# EAGLE design brake_controller (EAGLE 5.06)
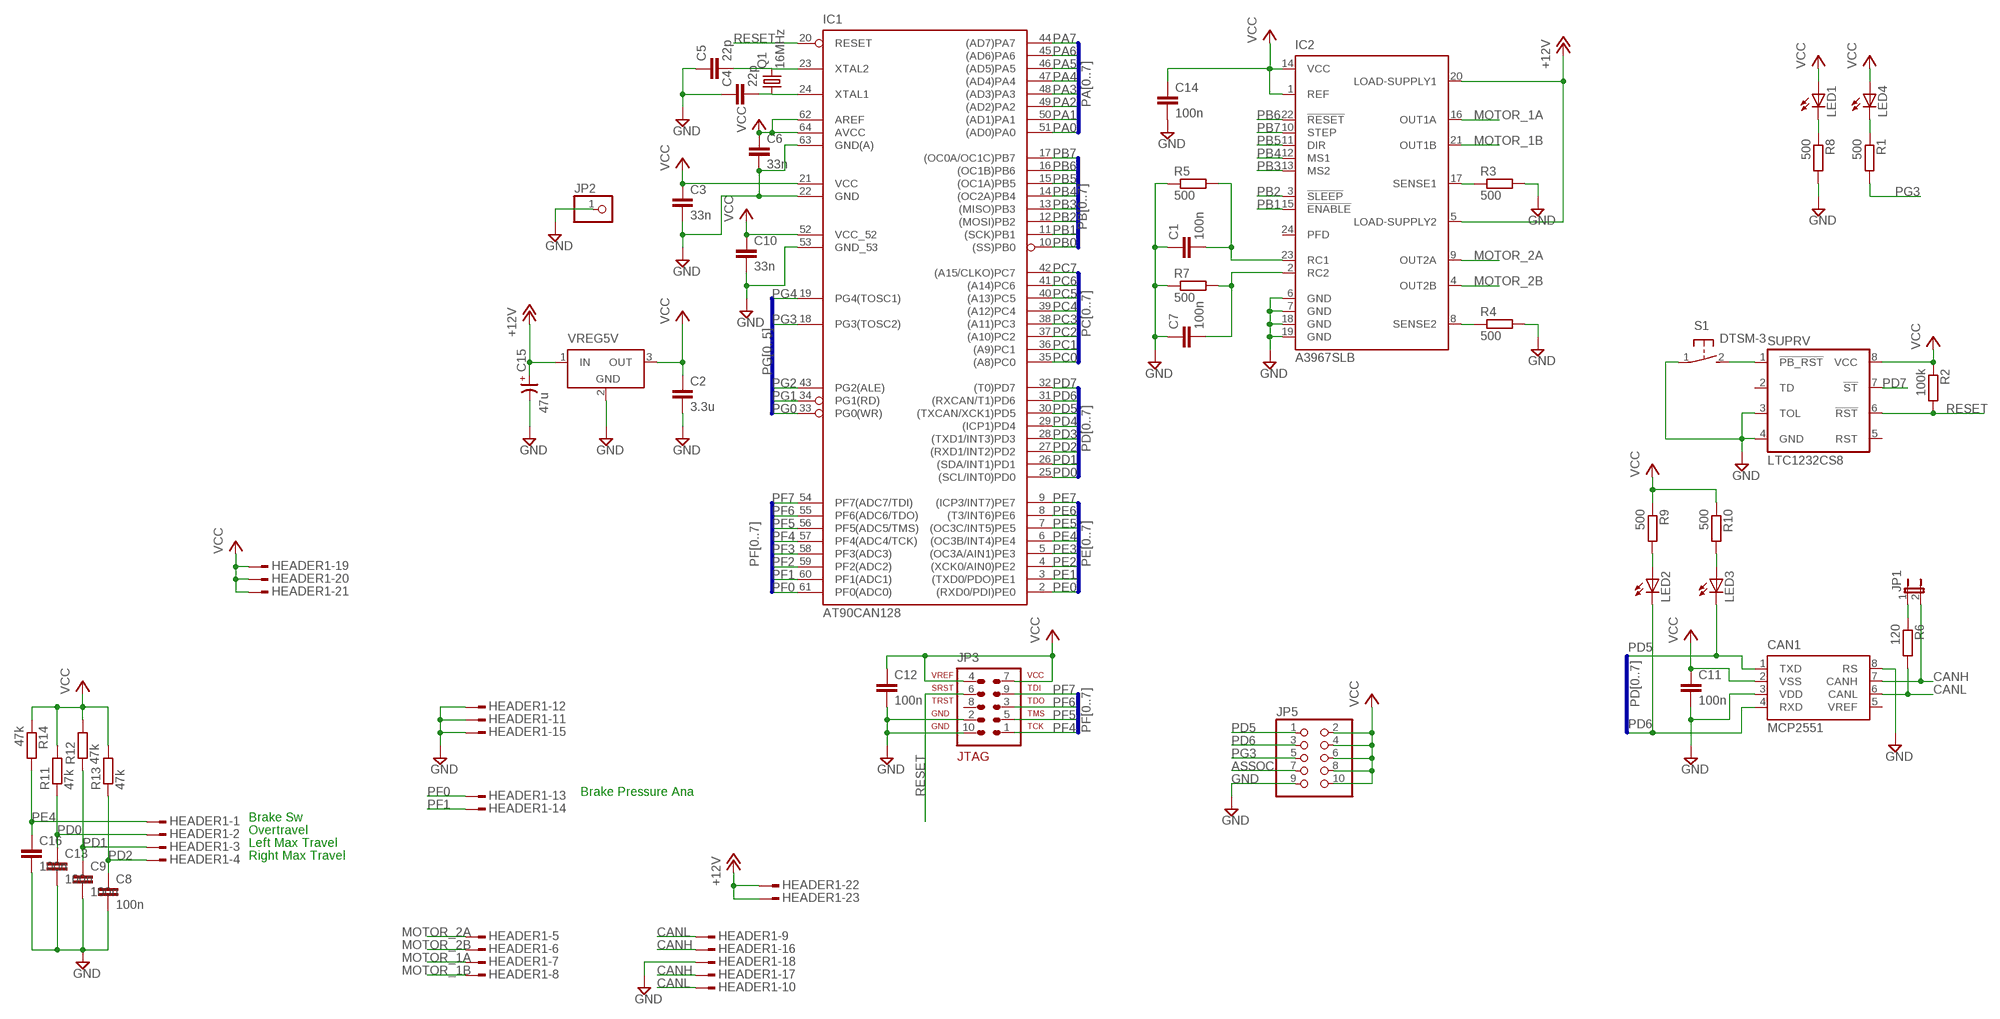
[diagram p0: schematic, sheet 1]

## Parts
C1  100n  C-EUC1206  [C1206]
C2  3.3u  C-EUC1206  [C1206]
C3  33n  C-EUC1206  [C1206]
C4  22p  C-EUC1206  [C1206]
C5  22p  C-EUC1206  [C1206]
C6  33n  C-EUC1206  [C1206]
C7  100n  C-EUC1206  [C1206]
C8  100n  C-EUC1206  [C1206]
C9  100n  C-EUC1206  [C1206]
C10  33n  C-EUC1206  [C1206]
C11  100n  C-EUC1206  [C1206]
C12  100n  C-EUC1206  [C1206]
C13  100n  C-EUC1206  [C1206]
C14  100n  C-EUC1206  [C1206]
C15  47u  CP-SV-E/F  [SV-E/F]
C16  100n  C-EUC1206  [C1206]
CAN1  MCP2551  [SOIC8]
HEADER1  AMPSEAL23-HEADER  [AMPSEAL23-HEADER]
IC1  AT90CAN128  [TQFP64]
IC2  A3967SLB  [SO24W]
JP1  JP1E  [JP1]
JP2  PINHD-1X1  [1X01]
JP3  AVR-JTAG-10  [AVR-JTAG-10]
JP5  PINHD-2X5  [2X05]
LED1  LEDCHIPLED_1206  [CHIPLED_1206]
LED2  LEDCHIPLED_1206  [CHIPLED_1206]
LED3  LEDCHIPLED_1206  [CHIPLED_1206]
LED4  LEDCHIPLED_1206  [CHIPLED_1206]
Q1  16MHz  CRYSTALHC49UP  [HC49UP]
R1  500  R-EU_R1206  [R1206]
R2  100k  R-EU_R1206  [R1206]
R3  500  R-EU_R1206  [R1206]
R4  500  R-EU_R1206  [R1206]
R5  500  R-EU_R1206  [R1206]
R6  120  R-EU_R1206  [R1206]
R7  500  R-EU_R1206  [R1206]
R8  500  R-EU_R1206  [R1206]
R9  500  R-EU_R1206  [R1206]
R10  500  R-EU_R1206  [R1206]
R11  47k  R-EU_R1206  [R1206]
R12  47k  R-EU_R1206  [R1206]
R13  47k  R-EU_R1206  [R1206]
R14  47k  R-EU_R1206  [R1206]
S1  DTSM-3  [DTSM-3]
SUPRV  LTC1232CS8  [SOIC8]
VREG5V  LT1129CST5  [SOT223]

## Nets
+12V: C15.+ HEADER1.22 HEADER1.23 IC2.5(LOAD-SUPPLY2) IC2.20(LOAD-SUPPLY1) VREG5V.1(IN)
ASSOC: JP5.7
CANH: CAN1.7(CANH) HEADER1.16 HEADER1.17 JP1.2
CANL: CAN1.6(CANL) HEADER1.9 HEADER1.10 R6.2
GND: C1.1 C2.2 C3.2 C4.1 C5.1 C6.2 C7.1 C8.2 C9.2 C10.2 C11.2 C12.2 C13.2 C14.2 C15.- C16.2 CAN1.3(VDD) CAN1.8(RS) HEADER1.11 HEADER1.12 HEADER1.15 HEADER1.18 IC1.22(GND) IC1.53(GND_53) IC1.63(GND(A)) IC2.6(GND) IC2.7(GND) IC2.18(GND) IC2.19(GND) JP2.1 JP3.2 JP3.10 JP5.9 R3.2 R4.2 R5.1 R7.1 R8.2 S1.1 SUPRV.3(TOL) SUPRV.4(GND) VREG5V.2(GND)
MOTOR_1A: HEADER1.7 IC2.16(OUT1A)
MOTOR_1B: HEADER1.8 IC2.21(OUT1B)
MOTOR_2A: HEADER1.5 IC2.9(OUT2A)
MOTOR_2B: HEADER1.6 IC2.4(OUT2B)
N$1: LED4.C R1.1
N$2: IC2.17(SENSE1) R3.1
N$3: IC2.8(SENSE2) R4.1
N$4: C5.2 IC1.23(XTAL2) Q1.2
N$5: C4.2 IC1.24(XTAL1) Q1.1
N$9: C1.2 IC2.23(RC1) R5.2
N$10: C7.2 IC2.2(RC2) R7.2
N$18: S1.2 SUPRV.1(!PB_RST)
N$19: JP1.1 R6.1
N$20: LED1.C R8.1
N$21: LED2.A R9.2
N$23: LED3.A R10.2
PA0: IC1.51((AD0)PA0)
PA1: IC1.50((AD1)PA1)
PA2: IC1.49((AD2)PA2)
PA3: IC1.48((AD3)PA3)
PA4: IC1.47((AD4)PA4)
PA5: IC1.46((AD5)PA5)
PA6: IC1.45((AD6)PA6)
PA7: IC1.44((AD7)PA7)
PB0: IC1.10((SS)PB0)
PB1: IC1.11((SCK)PB1) IC2.15(!ENABLE)
PB2: IC1.12((MOSI)PB2) IC2.3(!SLEEP)
PB3: IC1.13((MISO)PB3) IC2.13(MS2)
PB4: IC1.14((OC2A)PB4) IC2.12(MS1)
PB5: IC1.15((OC1A)PB5) IC2.11(DIR)
PB6: IC1.16((OC1B)PB6) IC2.22(!RESET)
PB7: IC1.17((OC0A/OC1C)PB7) IC2.10(STEP)
PC0: IC1.35((A8)PC0)
PC1: IC1.36((A9)PC1)
PC2: IC1.37((A10)PC2)
PC3: IC1.38((A11)PC3)
PC4: IC1.39((A12)PC4)
PC5: IC1.40((A13)PC5)
PC6: IC1.41((A14)PC6)
PC7: IC1.42((A15/CLKO)PC7)
PD0: C13.1 HEADER1.2 IC1.25((SCL/INT0)PD0) R11.1
PD1: C9.1 HEADER1.3 IC1.26((SDA/INT1)PD1) R12.1
PD2: C8.1 HEADER1.4 IC1.27((RXD1/INT2)PD2) R13.1
PD3: IC1.28((TXD1/INT3)PD3)
PD4: IC1.29((ICP1)PD4)
PD5: CAN1.1(TXD) IC1.30((TXCAN/XCK1)PD5) JP5.1 LED3.C
PD6: CAN1.4(RXD) IC1.31((RXCAN/T1)PD6) JP5.3 LED2.C
PD7: IC1.32((T0)PD7) SUPRV.7(!ST)
PE0: IC1.2((RXD0/PDI)PE0)
PE1: IC1.3((TXD0/PDO)PE1)
PE2: IC1.4((XCK0/AIN0)PE2)
PE3: IC1.5((OC3A/AIN1)PE3)
PE4: C16.1 HEADER1.1 IC1.6((OC3B/INT4)PE4) R14.2
PE5: IC1.7((OC3C/INT5)PE5)
PE6: IC1.8((T3/INT6)PE6)
PE7: IC1.9((ICP3/INT7)PE7)
PF0: HEADER1.13 IC1.61(PF0(ADC0))
PF1: HEADER1.14 IC1.60(PF1(ADC1))
PF2: IC1.59(PF2(ADC2))
PF3: IC1.58(PF3(ADC3))
PF4: IC1.57(PF4(ADC4/TCK)) JP3.1
PF5: IC1.56(PF5(ADC5/TMS)) JP3.5
PF6: IC1.55(PF6(ADC6/TDO)) JP3.3
PF7: IC1.54(PF7(ADC7/TDI)) JP3.9
PG0: IC1.33(PG0(WR))
PG1: IC1.34(PG1(RD))
PG2: IC1.43(PG2(ALE))
PG3: IC1.18(PG3(TOSC2)) JP5.5 R1.2
PG4: IC1.19(PG4(TOSC1))
RESET: IC1.20(RESET) JP3.6 R2.2 SUPRV.6(!RST)
VCC: C2.1 C3.1 C6.1 C10.1 C11.1 C12.1 C14.1 CAN1.2(VSS) HEADER1.19 HEADER1.20 HEADER1.21 IC1.21(VCC) IC1.52(VCC_52) IC1.62(AREF) IC1.64(AVCC) IC2.1(REF) IC2.14(VCC) JP3.4 JP3.7 JP5.2 JP5.4 JP5.6 JP5.8 JP5.10 LED1.A LED4.A R2.1 R9.1 R10.1 R11.2 R12.2 R13.2 R14.1 SUPRV.8(VCC) VREG5V.3(OUT)
Unconnected: IC2.24(PFD) JP3.8 SUPRV.2(TD) SUPRV.5(RST)

## Buses
PD[0..7]
PF[0..7]
PE[0..7]
PB[0..7]
PA[0..7]
PC[0..7]
PG[0..5]

## Notes on the sheet
- Brake Pressure Ana
- Brake Sw
- Overtravel
- Left Max Travel
- Right Max Travel

## Power pins joined to a net without a drawn wire
GND: VREG5V.4(GND)
VREF: CAN1.5(VREF)

## Library data of the parts
C1-C14 C16 = resistor:C-EU: CAPACITOR, European symbol
C15 = cap-master:CP-: POLARIZED CAP
CAN1 = MCP2551:MCP2551
HEADER1 = ampseal:AMPSEAL23-HEADER: HEADER ASSEMBLY, 23 POSITION, SNAP-IN, AMPSEAL
IC1 = at90can128:AT90CAN128
IC2 = allegro:A3967SLB: MICROSTEPPING DRIVER WITH TRANSLATOR Source: 3967.pdf
JP1 = jumper:JP1E: JUMPER
JP2 = pinhead:PINHD-1X1: PIN HEADER
JP3 = atmel:AVR-JTAG-10: AVR JTAG Debug/Programming Header
JP5 = pinhead:PINHD-2X5: PIN HEADER
LED1-LED4 = led:LED: LED OSRAM: - CHIPLED LG R971, LG N971, LY N971, LG Q971, LY Q971, LO R971, LY R971 LH N974, LH R974 LS Q976, LO Q976, LY Q976 LO Q996 - Hyper CHIPLED LW Q18S LB Q993, LB Q99A, LB R99A - SideLED LS A670, LO A670, LY A670, LG A670, LP A670 LB A673, LV A673, LT A673, LW A673 LH A674 LY A675 LS A676, LA A676, LO A676, LY A676, LW A676 LS A679, LY A679, LG A679 - Hyper Micro SIDELED® LS Y876, LA Y876, LO Y876, LY Y876 LT Y87S - SmartLED LW L88C, LW L88S LB L89C, LB L89S, LG L890 LS L89K, LO L89K, LY L89K LS L896, LA L896, LO L896, LY L896 - TOPLED LS T670, LO T670, LY T670, LG T670, LP T670 LSG T670, LSP T670, LSY T670, LOP T670, LYG T670 LG T671, LOG T671, LSG T671 LB T673, LV T673, LT T673, LW T673 LH T674 LS T676, LA T676, LO T676, LY T676, LB T676, LH T676, LSB T676, LW T676 LB T67C, LV T67C, LT T67C, LS T67K, LO T67K, LY T67K, LW E67C LS E67B, LA E67B, LO E67B, LY E67B, LB E67C, LV E67C, LT E67C LW T67C LS T679, LY T679, LG T679 LS T770, LO T770, LY T770, LG T770, LP T770 LB T773, LV T773, LT T773, LW T773 LH T774 LS E675, LA E675, LY E675, LS T675 LS T776, LA T776, LO T776, LY T776, LB T776 LHGB T686 LT T68C, LB T68C - Hyper Mini TOPLED® LB M676 - Mini TOPLED Santana® LG M470 LS M47K, LO M47K, LY M47K Source: http://www.osram.convergy.de LUXEON: - LUMILED® LXK2-PW12-R00, LXK2-PW12-S00, LXK2-PW14-U00, LXK2-PW14-V00 LXK2-PM12-R00, LXK2-PM12-S00, LXK2-PM14-U00 LXK2-PE12-Q00, LXK2-PE12-R00, LXK2-PE12-S00, LXK2-PE14-T00, LXK2-PE14-U00 LXK2-PB12-K00, LXK2-PB12-L00, LXK2-PB12-M00, LXK2-PB14-N00, LXK2-PB14-P00, LXK2-PB14-Q00 LXK2-PR12-L00, LXK2-PR12-M00, LXK2-PR14-Q00, LXK2-PR14-R00 LXK2-PD12-Q00, LXK2-PD12-R00, LXK2-PD12-S00 LXK2-PH12-R00, LXK2-PH12-S00 LXK2-PL12-P00, LXK2-PL12-Q00, LXK2-PL12-R00 Source: www.luxeon.com KINGBRIGHT: KA-3528ASYC Source: www.kingbright.com
Q1 = crystal:CRYSTAL: CRYSTAL
R1-R14 = resistor:R-EU_: RESISTOR, European symbol
S1 = switch-tact:DTSM-3
SUPRV = linear:LTC1232: Microprocessor Supervisory Circuit
VREG5V = linear-technology:LT1129CST5: VOLTAGE REGULATOR with shutdown

## Board
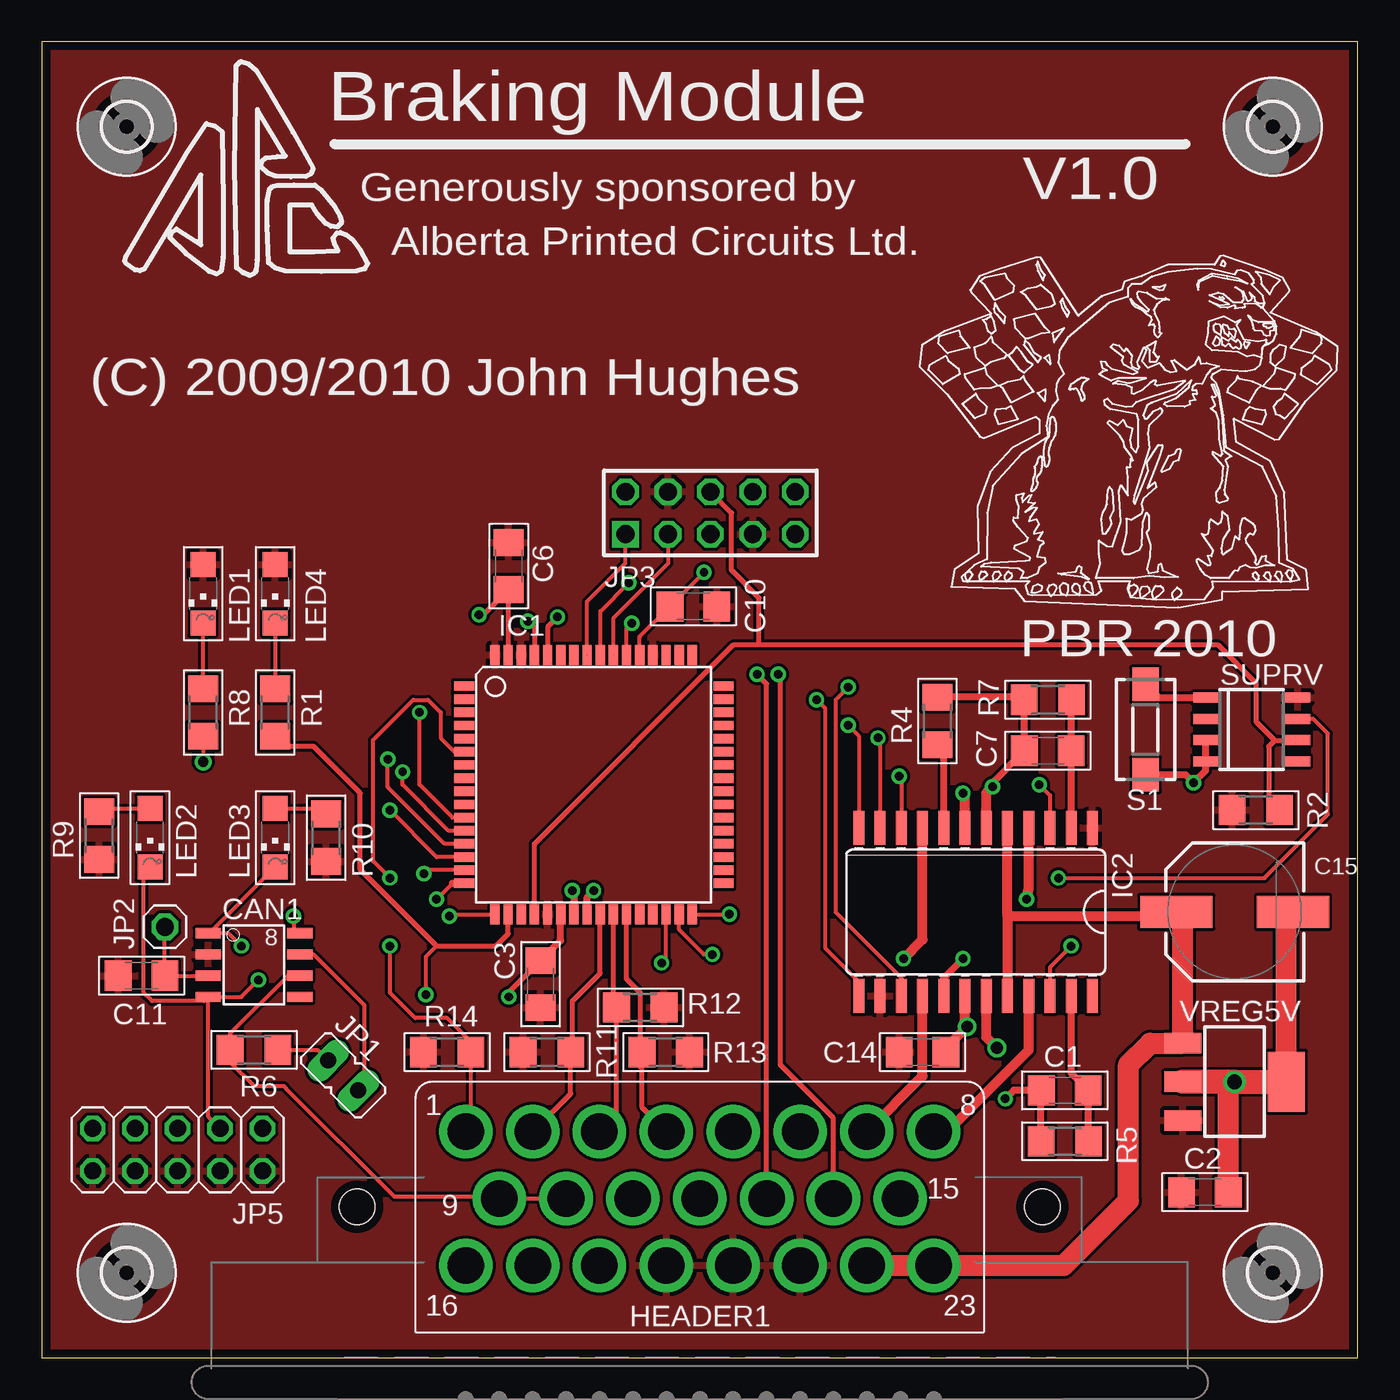
[diagram p1: board, top side]
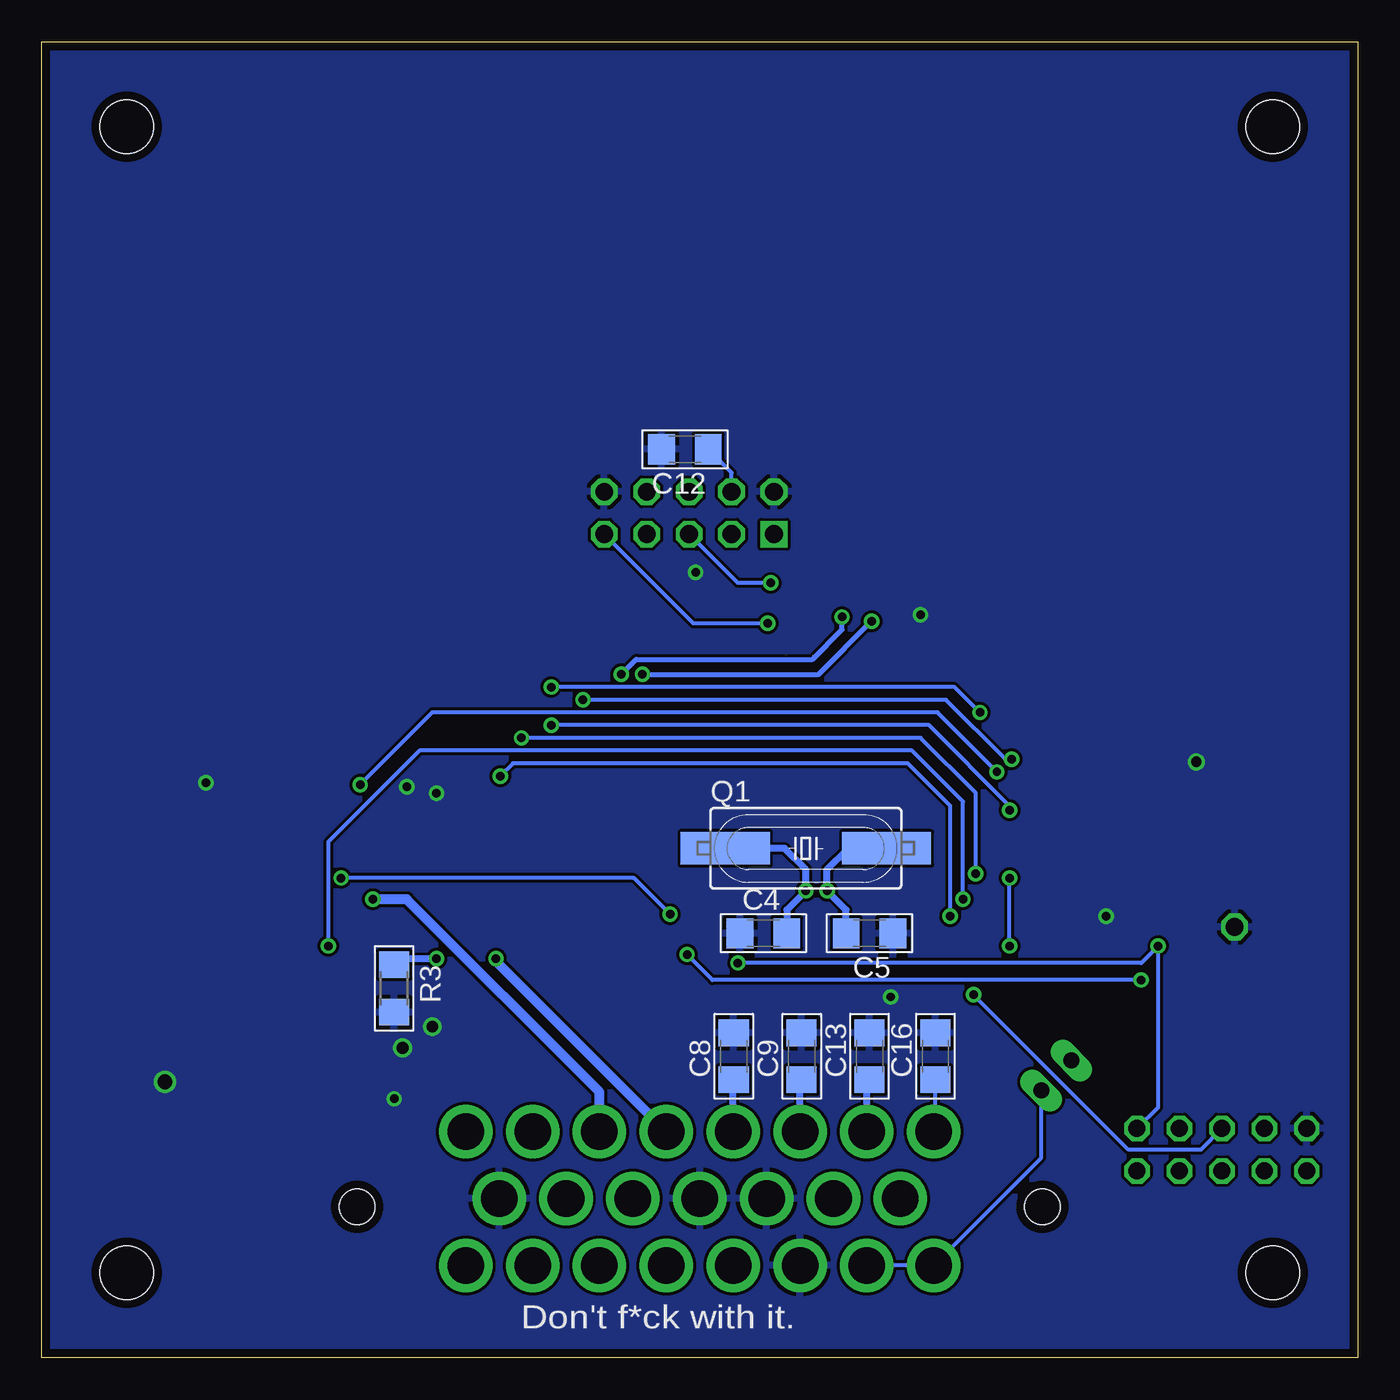
[diagram p2: board, bottom side, seen from below]

Size 78.74 x 78.74 mm. Coordinates in mm from the lower left corner, seen from the top.
Outline: 0,0 78.74,0 78.74,78.74 0,78.74 0,0
Copper layers (1*16): Top 0.035mm / dielectric 1.5mm / Bottom 0.035mm
Design rules "APCircuits": minimum track width 7mil, minimum drill 16mil, track to track 7mil, track to pad 7mil, pad to pad 7mil, via to via 7mil, smd to smd 7mil, copper to edge 20mil, drill to drill 7mil, minimum pad ring 10mil, minimum via ring 8mil, stop-mask expansion 4mil, vias tented up to drill 0mil, thermal gap 10mil

### Footprints (pad centres in the part's own frame; a part is rotated, then mirrored left to right if it is on the bottom)
C1206 = smd 1.6 x 1.8: 1 -1.4,0; 2 1.4,0
SV-E/F = smd 4.318 x 1.93: + -3.493,0; - 3.493,0
SOIC8 = smd 0.61 x 1.524: 1 -2.54,-2.743; 2 -1.27,-2.743; 3 0,-2.743; 4 1.27,-2.743; 5 1.27,2.743; 6 0,2.743; 7 -1.27,2.743; 8 -2.54,2.743
AMPSEAL23-HEADER = drill 2.184 round: 1 -14,4; 2 -10,4; 3 -6,4; 4 -2,4; 5 2,4; 6 6,4; 7 10,4; 8 14,4; 9 -12,0; 10 -8,0; 11 -4,0; 12 0,0; 13 4,0; 14 8,0; 15 12,0; 16 -14,-4; 17 -10,-4; 18 -6,-4; 19 -2,-4; 20 2,-4; 21 6,-4; 22 10,-4; 23 14,-4 | hole 2.108: -20.5,-0.5; 20.5,-0.5
TQFP64 = smd 1.194 x 0.559: 1 -7.76,5.905; 2 -7.76,5.118; 3 -7.76,4.331; 4 -7.76,3.543; 5 -7.76,2.756; 6 -7.76,1.968; 7 -7.76,1.181; 8 -7.76,0.394; 9 -7.76,-0.394; 10 -7.76,-1.181; 11 -7.76,-1.968; 12 -7.76,-2.756; 13 -7.76,-3.543; 14 -7.76,-4.331; 15 -7.76,-5.118; 16 -7.76,-5.905; 33 7.76,-5.905; 34 7.76,-5.118; 35 7.76,-4.331; 36 7.76,-3.543; 37 7.76,-2.756; 38 7.76,-1.968; 39 7.76,-1.181; 40 7.76,-0.394; 41 7.76,0.394; 42 7.76,1.181; 43 7.76,1.968; 44 7.76,2.756; 45 7.76,3.543; 46 7.76,4.331; 47 7.76,5.118; 48 7.76,5.905 | smd 0.559 x 1.194: 17 -5.905,-7.76; 18 -5.118,-7.76; 19 -4.331,-7.76; 20 -3.543,-7.76; 21 -2.756,-7.76; 22 -1.968,-7.76; 23 -1.181,-7.76; 24 -0.394,-7.76; 25 0.394,-7.76; 26 1.181,-7.76; 27 1.968,-7.76; 28 2.756,-7.76; 29 3.543,-7.76; 30 4.331,-7.76; 31 5.118,-7.76; 32 5.905,-7.76; 49 5.905,7.76; 50 5.118,7.76; 51 4.331,7.76; 52 3.543,7.76; 53 2.756,7.76; 54 1.968,7.76; 55 1.181,7.76; 56 0.394,7.76; 57 -0.394,7.76; 58 -1.181,7.76; 59 -1.968,7.76; 60 -2.756,7.76; 61 -3.543,7.76; 62 -4.331,7.76; 63 -5.118,7.76; 64 -5.905,7.76
SO24W = smd 0.66 x 2.032: 1 -6.985,-5.029; 2 -5.715,-5.029; 3 -4.445,-5.029; 4 -3.175,-5.029; 5 -1.905,-5.029; 6 -0.635,-5.029; 7 0.635,-5.029; 8 1.905,-5.029; 9 3.175,-5.029; 10 4.445,-5.029; 11 5.715,-5.029; 12 6.985,-5.029; 13 6.985,5.029; 14 5.715,5.029; 15 4.445,5.029; 16 3.175,5.029; 17 1.905,5.029; 18 0.635,5.029; 19 -0.635,5.029; 20 -1.905,5.029; 21 -3.175,5.029; 22 -4.445,5.029; 23 -5.715,5.029; 24 -6.985,5.029
JP1 = drill 0.965 long: 1 0,-1.27; 2 0,1.27
1X01 = drill 1.067 octagon: 1 0,0
AVR-JTAG-10 = drill 1.067 square: 1 -5.08,-1.27 | drill 1.067 octagon: 2 -5.08,1.27; 3 -2.54,-1.27; 4 -2.54,1.27; 5 0,-1.27; 6 0,1.27; 7 2.54,-1.27; 8 2.54,1.27; 9 5.08,-1.27; 10 5.08,1.27
2X05 = drill 1.016 octagon: 1 -5.08,-1.27; 2 -5.08,1.27; 3 -2.54,-1.27; 4 -2.54,1.27; 5 0,-1.27; 6 0,1.27; 7 2.54,-1.27; 8 2.54,1.27; 9 5.08,-1.27; 10 5.08,1.27
CHIPLED_1206 = smd 1.5 x 1.5: A 0,-1.75; C 0,1.75
HC49UP = smd 5.334 x 1.93: 1 -4.826,0; 2 4.826,0
R1206 = smd 1.6 x 1.803: 1 -1.422,0; 2 1.422,0
DTSM-3 = smd 2 x 1.6: 1 -2.7,0; 2 2.7,0
SOIC8' = smd 0.6 x 1.5: 1 -1.905,-2.75; 2 -0.635,-2.75; 3 0.635,-2.75; 4 1.905,-2.75; 5 1.905,2.75; 6 0.635,2.75; 7 -0.635,2.75; 8 -1.905,2.75
1/8" = hole 3.175: 0,0
SOT223 = smd 1.219 x 2.235: 1 -2.311,-3.099; 2 0,-3.099; 3 2.311,-3.099 | smd 3.6 x 2.2: 4 0,3.099

### Placement (x,y rotation side)
C1  61.21,16 0 top
C2  69.6,9.91 0 top
C3  29.84,22.35 90 top
C4  35.56,25.4 0 bottom
C5  29.21,25.4 180 bottom
C6  27.94,47.37 270 top
C7  60.2,36.32 0 top
C8  37.34,18.03 90 bottom
C9  33.27,18.03 90 bottom
C10  38.99,44.96 180 top
C11  5.97,22.86 0 top
C12  40.26,54.36 180 bottom
C13  29.21,18.03 90 bottom
C14  52.7,18.29 0 top
C15  71.37,26.67 0 top
C16  25.27,18.03 90 bottom
CAN1  12.7,22.86 270 top
HEADER1  39.37,9.53 0 top
IC1  33.02,34.29 0 top
IC2  55.88,26.67 180 top
JP1  18.03,16.89 225 top
JP2  7.37,25.78 90 top
JP3  40.01,50.55 0 top
JP5  8.13,12.45 180 top
LED1  9.65,45.72 180 top
LED2  6.48,31.11 180 top
LED3  13.97,31.11 180 top
LED4  13.97,45.72 180 top
Q1  33.02,30.48 0 bottom
R1  13.97,38.61 270 top
R2  72.64,32.77 0 top
R3  57.66,22.1 270 bottom
R4  53.59,38.1 90 top
R5  61.21,12.95 0 top
R6  12.7,18.41 180 top
R7  60.2,39.37 0 top
R8  9.65,38.61 270 top
R9  3.43,31.24 90 top
R10  17.02,31.11 90 top
R11  30.23,18.29 180 top
R12  35.81,20.95 0 top
R13  37.34,18.29 0 top
R14  24.26,18.29 0 top
S1  66.04,37.59 90 top
SUPRV  LTC1232CS8  [SOIC8']  72.39,37.59 270 top
U$1  [1/8"]  5.08,73.66 0 top
U$2  [1/8"]  73.66,73.66 0 top
U$3  [1/8"]  5.08,5.08 180 top
U$4  [1/8"]  73.66,5.08 180 top
VREG5V  71.37,16.51 270 top

### Tracks (layer width: path | path; a pad name or v marks a point on that pad's centre or on a via)
+12V
  Top 0.61: 57.78,26.42 IC2.20 | 57.78,26.42 IC2.5 | C15.+ 67.63,26.42 57.78,26.42
  Top 1.27: 68.28,26.28 VREG5V.1 66.32,18.82 65.02,17.53 65.02,9.4 61.15,5.53 HEADER1.23 HEADER1.22
  Top 1.422: 68.28,26.28 C15.+
CANH
  Top 0.254: CAN1.7 16.26,24.13 19.3,21.08 19.3,16.36 JP1.2
  Bottom 0.254: JP1.2 18.93,11.96 HEADER1.16 HEADER1.17
CANL
  Top 0.254: HEADER1.10 HEADER1.9 27.24,9.65 21.08,9.65 14.61,16.13 14.48,16.26 12.7,16.26 11.28,17.68 R6.2 11.28,19.41 14.73,22.86 CAN1.6
GND  (via drill 0.51, 0.61, 0.71, 0.89)
  Top 0.254: IC1.53 35.78,43.15 C10.2 v39.62,46.99 | v15.06,26.42 15.06,25.58 15.24,25.4 CAN1.8 | v9.66,35.66 R8.2 | CAN1.3 C11.2 JP2.1
  Top 0.305: C3.2 27.94,21.85 v27.94,21.59 | IC1.63 27.94,42.09 C6.2 26.42,44.45 v26.16,44.45
  Top 0.406: R5.1 59.79,15.98 C1.1 58.17,16 v57.66,15.49 | R4.2 58.62,39.52 R7.1 58.8,39.35 C7.1 56.9,34.42 v56.9,34.16 | IC1.22 31.05,24.96 C3.2 | S1.1 68.43,34.89 v68.91,34.41 69.64,35.13 SUPRV.4 SUPRV.3
  Top 0.61: IC2.18 55.24,20.07 v55.37,19.81 53.98,18.42 C14.2 | IC2.19 56.52,19.18 v57.15,18.54 | IC2.7 55.24,33.66 v55.12,33.78 | IC2.6 56.52,33.78 v56.9,34.16
  Top 1.27: VREG5V.4 74.47,26.28 | C2.2 71,16.13 v71.37,16.51
  Top 1.422: 74.47,26.28 C15.- | VREG5V.2 v71.37,16.51 VREG5V.4
  pour Bottom: 0,0 78.74,0 78.74,78.74 0,78.74
MOTOR_1A
  Top 0.61: IC2.16 52.7,16.86 HEADER1.7
MOTOR_1B
  Top 0.61: IC2.21 59.05,18.41 54.16,13.53 HEADER1.8
MOTOR_2A  (via drill 0.51)
  Top 0.61: IC2.9 52.7,25.02 v51.56,23.88
  Bottom 0.61: v51.56,23.88 51.56,23.72 HEADER1.5
MOTOR_2B  (via drill 0.51)
  Top 0.61: IC2.4 59.05,28.07 v58.93,27.43
  Bottom 0.61: v58.93,27.43 56.9,27.43 45.37,15.91 HEADER1.6
N$1
  Top 0.254: LED4.C R1.1
N$2  (via drill 0.51)
  Top 0.406: IC2.17 53.98,22.73 v55.12,23.88
  Bottom 0.406: v55.12,23.88 57.3,23.88 R3.1
N$3
  Top 0.406: IC2.8 53.98,36.3 R4.1
N$4  (via drill 0.51)
  Top 0.406: IC1.23 31.84,27.85 v31.75,27.94
  Bottom 0.406: C5.2 30.61,26.8 v31.75,27.94 31.75,29.21 30.48,30.48 Q1.2
N$5  (via drill 0.51)
  Top 0.406: IC1.24 32.63,27.55 v33.02,27.94
  Bottom 0.406: C4.2 34.16,26.8 v33.02,27.94 33.02,29.21 34.29,30.48 Q1.1
N$9
  Top 0.406: IC2.23 61.59,17.02 C1.2 62.64,15.98 R5.2
N$10
  Top 0.406: IC2.2 C7.2 61.6,39.35 R7.2
N$18
  Top 0.406: SUPRV.1 66.83,39.5 S1.2
N$19
  Top 0.254: 16.82,18.1 17.12,17.8 JP1.1 16.51,18.41 R6.1 13.96,18.64
N$20
  Top 0.254: LED1.C R8.1
N$21
  Top 0.254: LED2.A 3.61,32.86 3.43,32.68 R9.2
N$23
  Top 0.254: LED3.A 13.98,32.88 16.66,32.88 17,32.54 R10.2
PB1  (via drill 0.51)
  Top 0.254: v48.26,40.13 47.5,39.37 47.5,26.67 51.44,22.73 IC2.15 | IC1.11 24.57,32.32 22.61,34.29 v22.61,38.61
  Bottom 0.254: v22.61,38.61 24.13,40.13 v48.26,40.13
PB2  (via drill 0.51)
  Top 0.254: IC1.12 24.35,31.53 21.59,34.29 v21.59,35.05 | IC2.3 60.33,33.66 v59.69,34.29
  Bottom 0.254: v21.59,35.05 25.15,38.61 48.01,38.61 55.37,38.61 v59.69,34.29
PB3  (via drill 0.51)
  Top 0.254: IC1.13 24.12,30.75 20.7,34.16 v20.7,35.81 | IC2.13 48.9,22.48 46.86,24.51 46.86,38.86 v46.35,39.37
  Bottom 0.254: v46.35,39.37 24.64,39.37 21.08,35.81 v20.7,35.81
PB4  (via drill 0.51)
  Top 0.254: v48.26,37.85 48.9,37.21 IC2.12 | IC1.14 23.64,29.96 v20.83,32.77
  Bottom 0.254: v48.26,37.85 25.65,37.85 20.83,33.02 v20.83,32.77
PB5  (via drill 0.51)
  Top 0.254: IC1.15 23.08,29.17 | IC2.11 50.16,37.21 v50.04,37.08
  Top 0.406: 23.08,29.17 v22.86,28.96
  Bottom 0.254: v22.86,28.96 22.86,33.78 26.16,37.08 v50.04,37.08
PB6  (via drill 0.51)
  Top 0.254: v23.62,27.43 24.57,28.38 | IC2.22 60.33,23.37 v61.59,24.64
  Top 0.406: 24.57,28.38 IC1.16
  Bottom 0.254: v23.62,27.43 23.62,33.27 26.67,36.32 56.13,36.32 61.59,30.86 v61.59,24.64
PB7  (via drill 0.51)
  Top 0.254: 24.5,26.53 IC1.17 | IC2.10 51.44,34.67 v51.31,34.8
  Top 0.406: v24.38,26.42 24.5,26.53
  Bottom 0.254: v24.38,26.42 24.38,33.02 26.92,35.56 50.55,35.56 v51.31,34.8
PD0
  Top 0.305: IC1.25 33.41,23 31.75,21.34 31.75,18.14 R11.1 31.65,15.8 HEADER1.2
  Bottom 0.406: HEADER1.2 29.37,16.47 C13.1
PD1
  Top 0.305: IC1.26 34.2,20.77 R12.1 34.39,14.55 HEADER1.3
  Bottom 0.406: HEADER1.3 33.37,16.54 C9.1
PD2
  Top 0.305: IC1.27 34.99,22.67 35.81,21.84 35.81,17.37 R13.1 35.92,14.98 HEADER1.4
  Bottom 0.406: HEADER1.4 37.37,16.6 C8.1
PD5  (via drill 0.51)
  Top 0.254: LED3.C 10.01,25.4 CAN1.1 11.18,25.4 v11.94,24.64 | IC1.30 37.35,23.89 v37.08,23.62
  Bottom 0.254: JP5.1 11.94,14.99 v11.94,24.64 12.95,23.62 v37.08,23.62
PD6  (via drill 0.51)
  Top 0.254: JP5.3 9.96,14.43 CAN1.4 | CAN1.4 9.7,21.34 6.6,21.34 6.1,21.84 6.1,28.98 LED2.C | v40.13,24.13 39.62,24.13 38.14,25.62 IC1.31 | CAN1.4 11.94,21.59 v12.95,22.61
  Bottom 0.254: v12.95,22.61 38.61,22.61 v40.13,24.13
PD7  (via drill 0.51)
  Top 0.254: SUPRV.7 76.07,38.23 76.96,37.34 76.96,32.51 73.15,28.7 v60.83,28.7 | v41.15,26.54 40.75,26.53 IC1.32
  Bottom 0.254: v60.83,28.7 43.31,28.7 v41.15,26.54
PE4  (via drill 0.51)
  Top 0.254: IC1.6 24.7,36.26 23.88,37.08 23.88,38.61 23.11,39.37 22.23,39.37 19.81,36.96 19.81,29.72 v20.83,28.7 | v20.83,24.64 20.83,21.84 22.35,20.32 24.26,20.32 25.68,18.9 R14.2 25.68,13.83 HEADER1.1
  Bottom 0.254: v20.83,24.64 v20.83,28.7 | C16.1 25.27,13.62 HEADER1.1
PF0  (via drill 0.51)
  Top 0.305: HEADER1.13 43.37,40.32 v42.8,40.89 | v29.08,44.07 29.48,43.67 IC1.61
  Bottom 0.305: v42.8,40.89 32.26,40.89 v29.08,44.07
PF1  (via drill 0.51)
  Top 0.305: HEADER1.14 47.37,14.35 44.2,17.53 44.2,40.77 v44.07,40.89 | v30.86,44.32 30.26,43.73 IC1.60
  Bottom 0.305: v44.07,40.89 43.18,41.78 32.64,41.78 30.86,43.56 v30.86,44.32
PF4  (1 unrouted)
  Top 0.254: JP3.1 34.92,49.26 34.92,47.54 32.64,45.26 IC1.57
PF5  (via drill 0.51)
  Top 0.254: IC1.56 33.42,44.66 v35.12,46.36
  Bottom 0.254: JP3.5 37.09,46.36 v35.12,46.36
PF6  (1 unrouted)
  Top 0.254: 34.22,42.06 34.22,42.38 34.22,44.26 34.36,44.4 37.5,47.54 37.5,49.24 37.48,49.26 JP3.3
PF7  (via drill 0.51)
  Top 0.254: IC1.54 34.99,43.62 v35.31,43.94
  Bottom 0.254: v35.31,43.94 39.75,43.94 JP3.9
PG3  (via drill 0.51)
  Top 0.254: v22.99,21.72 22.99,24 23.62,24.64
  Top 0.305: IC1.18 27.9,25.36 27.18,24.64 23.62,24.64 19.05,29.21 19.05,33.78 16.26,36.58 14.58,36.58 R1.2
  Bottom 0.254: JP5.5 9.4,12.45 13.72,12.45 v22.99,21.72
RESET
  Top 0.254: IC1.20 | R2.2 74.06,33.54 | 75.12,36.94 SUPRV.6
  Top 0.305: 73.77,36.94 75.12,36.94 | 73.77,36.94 73.41,36.58 73.41,33.43 R2.2 | 73.77,36.94 72.64,38.07 72.64,40.39 70.36,42.67 42.93,42.67 | 42.93,42.67 41.39,42.67 29.48,30.76 IC1.20 | JP3.6 41.27,50.55 41.27,47.12 42.93,45.47 42.93,42.67
VCC
  Bottom 0.254: C12.1 37.47,52.96 JP3.4
  pour Top: 0,0 78.74,0 78.74,78.74 0,78.74

### Text on the board
tPlace: Braking Module | Generously sponsored by | V1.0 | Alberta Printed Circuits Ltd. | (C) 2009/2010 John Hughes | PBR 2010
bPlace: Don't f*ck with it.